# Altium project hd-gs.PrjPcb
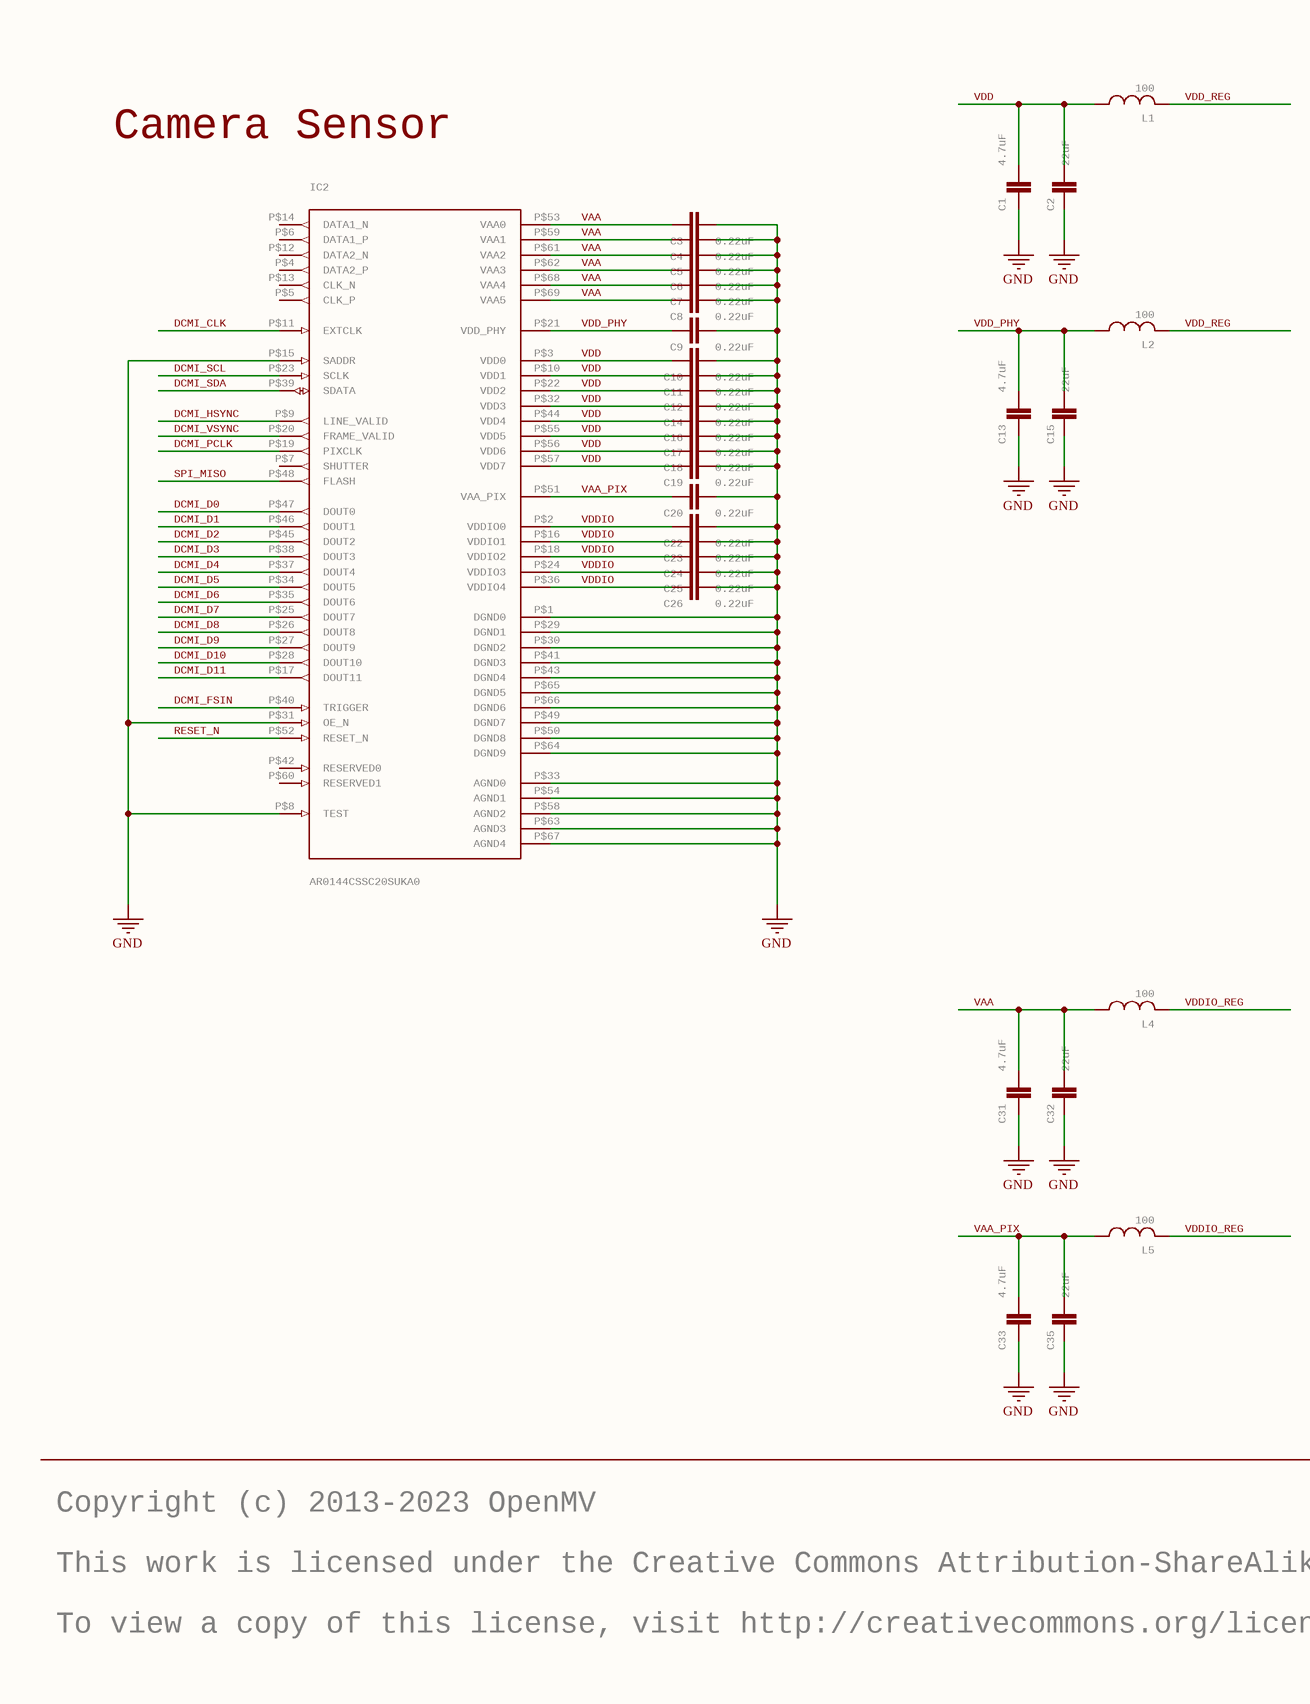
[diagram p0: hd-gs.SchDoc, left]
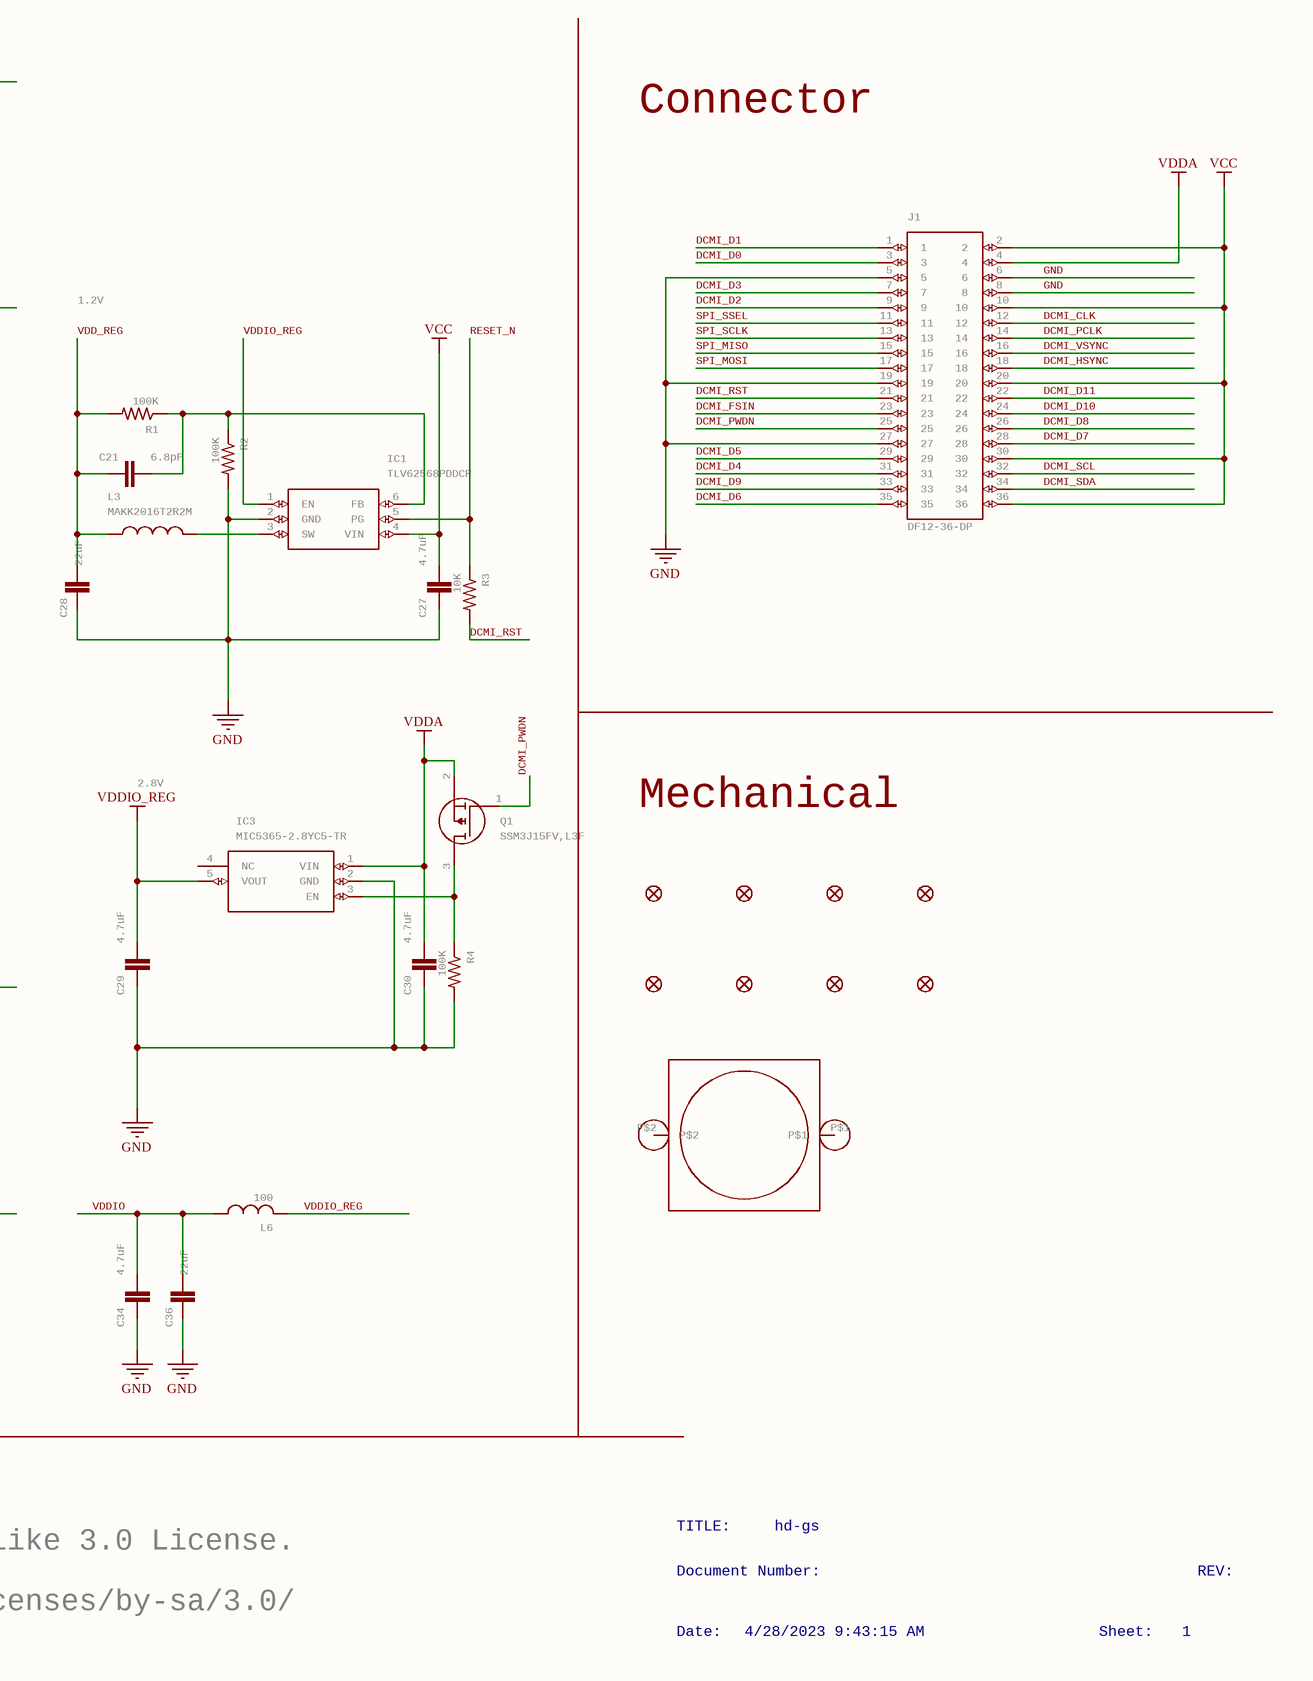
[diagram p1: hd-gs.SchDoc, right]
1 sheet, 60 parts. Net scope: global (net labels, ports and power ports of the same name join across sheets).
Board file: hd-gs.PcbDoc

## Sheet hd-gs.SchDoc: hd-gs
size 453 x 317 mm; Origin: Eagle; Date: 4/28/2023 9:43:15 AM; SheetNumber: 1; GateName_1: G$1; SymbolName_1: FRAME_B_L; LibraryName: frames; DeviceSetName: FRAME_B_L; GateName_2: G$2; SymbolName_2: DOCFIELD; Sheet: Sheet:; REV: REV:

### Parts
C1  4.7uF  [0402]
C2  22uF  [0805]
C3  0.22uF  [C0201]
C4  0.22uF  [C0201]
C5  0.22uF  [C0201]
C6  0.22uF  [C0201]
C7  0.22uF  [C0201]
C8  0.22uF  [C0201]
C9  0.22uF  [C0201]
C10  0.22uF  [C0201]
C11  0.22uF  [C0201]
C12  0.22uF  [C0201]
C13  4.7uF  [0402]
C14  0.22uF  [C0201]
C15  22uF  [0805]
C16  0.22uF  [C0201]
C17  0.22uF  [C0201]
C18  0.22uF  [C0201]
C19  0.22uF  [C0201]
C20  0.22uF  [C0201]
C21  6.8pF  [0402]
C22  0.22uF  [C0201]
C23  0.22uF  [C0201]
C24  0.22uF  [C0201]
C25  0.22uF  [C0201]
C26  0.22uF  [C0201]
C27  4.7uF  [0402]
C28  22uF  [0805]
C29  4.7uF  [0402]
C30  4.7uF  [0402]
C31  4.7uF  [0402]
C32  22uF  [0805]
C33  4.7uF  [0402]
C34  4.7uF  [0402]
C35  22uF  [0805]
C36  22uF  [0805]
FD1  FIDUCIAL1X2  [FIDUCIAL-1X2]  (value not drawn)
FD2  FIDUCIAL1X2  [FIDUCIAL-1X2]  (value not drawn)
FD3  FIDUCIAL1X2  [FIDUCIAL-1X2]  (value not drawn)
FD4  FIDUCIAL1X2  [FIDUCIAL-1X2]  (value not drawn)
FD5  FIDUCIAL1X2  [FIDUCIAL-1X2]  (value not drawn)
FD6  FIDUCIAL1X2  [FIDUCIAL-1X2]  (value not drawn)
FD7  FIDUCIAL1X2  [FIDUCIAL-1X2]  (value not drawn)
FD8  FIDUCIAL1X2  [FIDUCIAL-1X2]  (value not drawn)
H1  LENSMOUNT20MM  [LENSMOUNT-20MM]  (value not drawn)
IC1  TLV62568PDDCR  [SOT95P280X110-6N]
IC2  AR0144CSSC20SUKA0  [AR0144CSSC20SUKA0]
IC3  MIC5365-2.8YC5-TR  [SOT65P210X110-5N]
J1  DF12-36-DP  [DF12-36-DP]
L1  100  [0402]
L2  100  [0402]
L3  MAKK2016T2R2M  [INDC2016X100N]
L4  100  [0402]
L5  100  [0402]
L6  100  [0402]
Q1  SSM3J15FV,L3F  [SSM3J15FV]
R1  100K  [R0402]
R2  100K  [R0402]
R3  10K  [R0402]
R4  100K  [R0402]

### Nets
GND: C1.1 C2.1 C3.2 C4.2 C5.2 C6.2 C7.2 C8.2 C9.2 C10.2 C11.2 C12.2 C13.1 C14.2 C15.1 C16.2 C17.2 C18.2 C19.2 C20.2 C22.2 C23.2 C24.2 C25.2 C26.2 C27.1 C28.1 C29.1 C30.1 C31.1 C32.1 C33.1 C34.1 C35.1 C36.1 IC1.2(GND) IC2.P$1(DGND0) IC2.P$8(TEST) IC2.P$15(SADDR) IC2.P$29(DGND1) IC2.P$30(DGND2) IC2.P$31(OE_N) IC2.P$33(AGND0) IC2.P$41(DGND3) IC2.P$43(DGND4) IC2.P$49(DGND7) IC2.P$50(DGND8) IC2.P$54(AGND1) IC2.P$58(AGND2) IC2.P$63(AGND3) IC2.P$64(DGND9) IC2.P$65(DGND5) IC2.P$66(DGND6) IC2.P$67(AGND4) IC3.2(GND) J1.5 J1.6 J1.8 J1.19 J1.27 R2.2 R4.2
VCC: C27.2 IC1.4(VIN) J1.2 J1.10 J1.20 J1.30 J1.36
VDDA: C30.2 IC3.1(VIN) J1.4 Q1.2(S)
VDDIO_REG: C29.2 IC1.1(EN) IC3.5(VOUT) L4.2(P$2) L5.2(P$2) L6.2(P$2)
DCMI_CLK: IC2.P$11(EXTCLK) J1.12
DCMI_D0: IC2.P$47(DOUT0) J1.3
DCMI_D1: IC2.P$46(DOUT1) J1.1
DCMI_D2: IC2.P$45(DOUT2) J1.9
DCMI_D3: IC2.P$38(DOUT3) J1.7
DCMI_D4: IC2.P$37(DOUT4) J1.31
DCMI_D5: IC2.P$34(DOUT5) J1.29
DCMI_D6: IC2.P$35(DOUT6) J1.35
DCMI_D7: IC2.P$25(DOUT7) J1.28
DCMI_D8: IC2.P$26(DOUT8) J1.26
DCMI_D9: IC2.P$27(DOUT9) J1.33
DCMI_D10: IC2.P$28(DOUT10) J1.24
DCMI_D11: IC2.P$17(DOUT11) J1.22
DCMI_FSIN: IC2.P$40(TRIGGER) J1.23
DCMI_HSYNC: IC2.P$9(LINE_VALID) J1.18
DCMI_PCLK: IC2.P$19(PIXCLK) J1.14
DCMI_PWDN: J1.25 Q1.1(G)
DCMI_RST: J1.21 R3.2
DCMI_SCL: IC2.P$23(SCLK) J1.32
DCMI_SDA: IC2.P$39(SDATA) J1.34
DCMI_VSYNC: IC2.P$20(FRAME_VALID) J1.16
RESET_N: IC1.5(PG) IC2.P$52(RESET_N) R3.1
SPI_MISO: IC2.P$48(FLASH) J1.15
SPI_MOSI: J1.17
SPI_SCLK: J1.13
SPI_SSEL: J1.11
VAA: C3.1 C4.1 C5.1 C6.1 C7.1 C8.1 C31.2 C32.2 IC2.P$53(VAA0) IC2.P$59(VAA1) IC2.P$61(VAA2) IC2.P$62(VAA3) IC2.P$68(VAA4) IC2.P$69(VAA5) L4.1(P$1)
VAA_PIX: C20.1 C33.2 C35.2 IC2.P$51(VAA_PIX) L5.1(P$1)
VDD: C1.2 C2.2 C10.1 C11.1 C12.1 C14.1 C16.1 C17.1 C18.1 C19.1 IC2.P$3(VDD0) IC2.P$10(VDD1) IC2.P$22(VDD2) IC2.P$32(VDD3) IC2.P$44(VDD4) IC2.P$55(VDD5) IC2.P$56(VDD6) IC2.P$57(VDD7) L1.1(P$1)
VDD_PHY: C9.1 C13.2 C15.2 IC2.P$21(VDD_PHY) L2.1(P$1)
VDD_REG: C21.1 C28.2 L1.2(P$2) L2.2(P$2) L3.1 R1.2
VDDIO: C22.1 C23.1 C24.1 C25.1 C26.1 C34.2 C36.2 IC2.P$2(VDDIO0) IC2.P$16(VDDIO1) IC2.P$18(VDDIO2) IC2.P$24(VDDIO3) IC2.P$36(VDDIO4) L6.1(P$1)
NetC21_2: C21.2 IC1.6(FB) R1.1 R2.1
NetIC1_3: IC1.3(SW) L3.2
NetIC3_3: IC3.3(EN) Q1.3(D) R4.1

Not connected (* = marked no-connect by the designer): H1 P$1 P$2; IC2 P$4(DATA2_P) P$5(CLK_P) P$6(DATA1_P) P$7(SHUTTER) P$12(DATA2_N) P$13(CLK_N) P$14(DATA1_N) P$42(RESERVED0) P$60(RESERVED1); IC3 4(NC)

### Notes on the sheet
- Camera Sensor
- Connector
- 1.2V
- 2.8V
- Mechanical
- Copyright (c) 2013-2023 OpenMV
- TITLE:
- hd-gs
- This work is licensed under the Creative Commons Attribution-ShareAlike 3.0 License.
- To view a copy of this license, visit http://creativecommons.org/licenses/by-sa/3.0/
- Document Number:
- REV:
- Date:
- 4/28/2023 9:43:15 AM
- Sheet:
- 1

### Library data of the parts
C1 C13 C27 C29-C31 C33 C34 = CAP_0402: 0402 (1005 Metric) Nick Garner - TeleSense; MPN: JMK105BBJ475MV-F; GateName_1: G$1; SymbolName_1: CAP; LibraryName: 0402; DeviceSetName: CAP_0402
C2 C15 C28 C32 C35 C36 = 22UF-0805-6.3V-20%: 22ÂµF ceramic capacitors    A capacitor is a passive two-terminal electrical component used to store electrical energy temporarily in an electric field.; MPN: CL21A226MQQNNNE; GateName_1: G$1; SymbolName_1: CAP; PROD_ID: CAP-08402; DeviceName: -0805-6.3V-20%; LibraryName: SparkFun-Capacitors; DeviceSetName: 22UF
C3-C12 C14 C16-C20 C22-C26 = C-EUC0201: CAPACITOR, European symbol; MPN: GRM033R60J224ME15D; GateName_1: G$1; SymbolName_1: C-EU; POPULARITY: 0; DeviceName: C0201; LibraryName: rcl; DeviceSetName: C-EU; SPICEPREFIX: C
C21 = CAP_0402: 0402 (1005 Metric) Nick Garner - TeleSense; MPN: GRM1555C1H6R8DA01D; GateName_1: G$1; SymbolName_1: CAP; LibraryName: 0402; DeviceSetName: CAP_0402
FD1-FD8 = FIDUCIAL1X2: Fiducial Alignment Points    Point-of-reference for pick-and-place machines and other optical instruments.; GateName_1: G$1; DeviceName: 1X2; SymbolName_1: FIDUCIAL; LibraryName: SparkFun-Aesthetics; DeviceSetName: FIDUCIAL
H1 = LENSMOUNT20MM: GateName_1: G$1; SymbolName_1: LENS; DeviceName: 20MM; LibraryName: lensmount; DeviceSetName: LENSMOUNT
IC1 = TLV62568PDDCR: 2.5V-5.5V input, 1A high efficiency step-down buck converter in SOT23 and SOT563 package   Source:  Datasheet; MANUFACTURER_NAME: Texas Instruments; GateName_1: G$1; SymbolName_1: TLV62568PDDCR; LibraryName: TLV62568PDDCR; DeviceSetName: TLV62568PDDCR; HEIGHT: 1.1mm; MANUFACTURER_PART_NUMBER: TLV62568PDDCR; MOUSER_PART_NUMBER: 595-TLV62568PDDCR; MOUSER_PRICE-STOCK: https://www.mouser.co.uk/ProductDetail/Texas-Instruments/TLV62568PDDCR?qs=1mbolxNpo8f1FPchIXcxyQ%3D%3D; MPN: TLV62568PDDCR
IC2 = AR0144CSSC20SUKA0: MPN: AR0144CSSC20SUKA0-CRBR; GateName_1: G$1; SymbolName_1: AR0144CSSC20SUKA0; LibraryName: AR0144CSSC20SUKA0; DeviceSetName: AR0144CSSC20SUKA0
IC3 = MIC5365-2.8YC5-TR: IC REG LINEAR 2.8V 150MA SC70-5   Source:  Datasheet; MANUFACTURER_NAME: Microchip; GateName_1: G$1; SymbolName_1: MIC5365-2.8YC5-TR; LibraryName: MIC5365-2.8YC5-TR; DeviceSetName: MIC5365-2.8YC5-TR; HEIGHT: 1.1mm; MANUFACTURER_PART_NUMBER: MIC5365-2.8YC5-TR; MOUSER_PART_NUMBER: 998-MIC5365-2.8YC5TR; MOUSER_PRICE-STOCK: https://www.mouser.co.uk/ProductDetail/Microchip-Technology-Atmel/MIC5365-2.8YC5-TR?qs=U6T8BxXiZAX3mJDSWJyjVA%3D%3D; MPN: MIC5365-2.8YC5-TR
J1 = DF12-36-DP: MPN: DF12NB(3.0)-36DP-0.5V(51); GateName_1: G$1; SymbolName_1: DF12-36; LibraryName: DF12NB(3.0)-36DP-0.5V(51); DeviceSetName: DF12-36-DP
L1 L2 L4-L6 = INDUCTOR_0402: MPN: MFBM1V1005-101-R; GateName_1: G$1; SymbolName_1: INDUCTOR; LibraryName: 0402; DeviceSetName: INDUCTOR_0402
L3 = MAKK2016T2R2M: INDUCTOR, METAL CORE Check availability; GateName_1: G$1; MF: Taiyo Yuden; SymbolName_1: MAKK2016T2R2M; LibraryName: MAKK2016T2R2M; DeviceSetName: MAKK2016T2R2M; AVAILABILITY: In Stock; MP: MAKK2016T2R2M; MPN: MAKK2016T2R2M; PACKAGE: 2016 Taiyo Yuden; PRICE: None; PURCHASE-URL: https://pricing.snapeda.com/search/part/MAKK2016T2R2M/?ref=eda
Q1 = PMXB120EPEZ: MOSFET 30 V, P-channel Trench MOSFET   Source:  Datasheet; GateName_1: G$1; SymbolName_1: SSM3J15FV,L3F; LibraryName: SSM3J15FV,L3F; DeviceSetName: SSM3J15FV,L3F; HEIGHT: 0.4mm; MANUFACTURER_PART_NUMBER: SSM3J15FV,L3F; MPN: SSM3J15FV,L3F
R1 R2 R4 = R-US_R0402: RESISTOR, American symbol; MPN: AC0402FR-07100KL; GateName_1: G$1; SymbolName_1: R-US; DeviceSetName: R-US_; POPULARITY: 34; DeviceName: R0402; LibraryName: rcl; SPICEPREFIX: R
R3 = R-US_R0402: RESISTOR, American symbol; MPN: AC0402FR-1310KL; GateName_1: G$1; SymbolName_1: R-US; DeviceSetName: R-US_; POPULARITY: 34; DeviceName: R0402; LibraryName: rcl; SPICEPREFIX: R